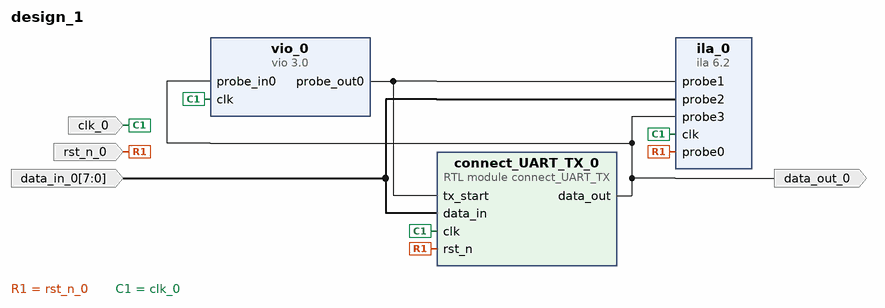
[diagram p0: block diagram of the top level]
# Vivado block design design_1, xc7a35ticsg324-1L, Vivado 2020.2
create_bd_design design_1

create_bd_port -dir I -type rst rst_n_0
create_bd_port -dir I -type clk clk_0
create_bd_port -dir O data_out_0
create_bd_port -dir I -from 7 -to 0 data_in_0

create_bd_cell -type ip -vlnv xilinx.com:ip:ila:6.2 ila_0
set_property -dict [list \
  CONFIG.C_ENABLE_ILA_AXI_MON false \
  CONFIG.C_MONITOR_TYPE Native \
  CONFIG.C_NUM_OF_PROBES 4 \
  CONFIG.C_PROBE2_WIDTH 8 \
] [get_bd_cells ila_0]
create_bd_cell -type ip -vlnv xilinx.com:ip:vio:3.0 vio_0
set_property -dict {CONFIG.C_NUM_PROBE_OUT 1 CONFIG.C_PROBE_OUT1_WIDTH 8} [get_bd_cells vio_0]
create_bd_cell -type module -reference connect_UART_TX connect_UART_TX_0

# ---- connections ----

connect_bd_net -net rst_n_0_1 [get_bd_ports rst_n_0] [get_bd_pins ila_0/probe0] [get_bd_pins connect_UART_TX_0/rst_n]
connect_bd_net -net tx_start_0_1 [get_bd_pins vio_0/probe_out0] [get_bd_pins ila_0/probe1] [get_bd_pins connect_UART_TX_0/tx_start]
connect_bd_net -net clk_0_1 [get_bd_ports clk_0] [get_bd_pins ila_0/clk] [get_bd_pins vio_0/clk] [get_bd_pins connect_UART_TX_0/clk]
connect_bd_net -net data_in_0_1 [get_bd_ports data_in_0] [get_bd_pins ila_0/probe2] [get_bd_pins connect_UART_TX_0/data_in]
connect_bd_net [get_bd_pins connect_UART_TX_0/data_out] [get_bd_ports data_out_0] [get_bd_pins ila_0/probe3] [get_bd_pins vio_0/probe_in0]

validate_bd_design
save_bd_design
